# Altium schematic sheet Smart 4S and 5S switchable BMS [BQ769200].SchDoc (part 1 of 2)
size A3; SheetNumber: 1; SheetTotal: 1
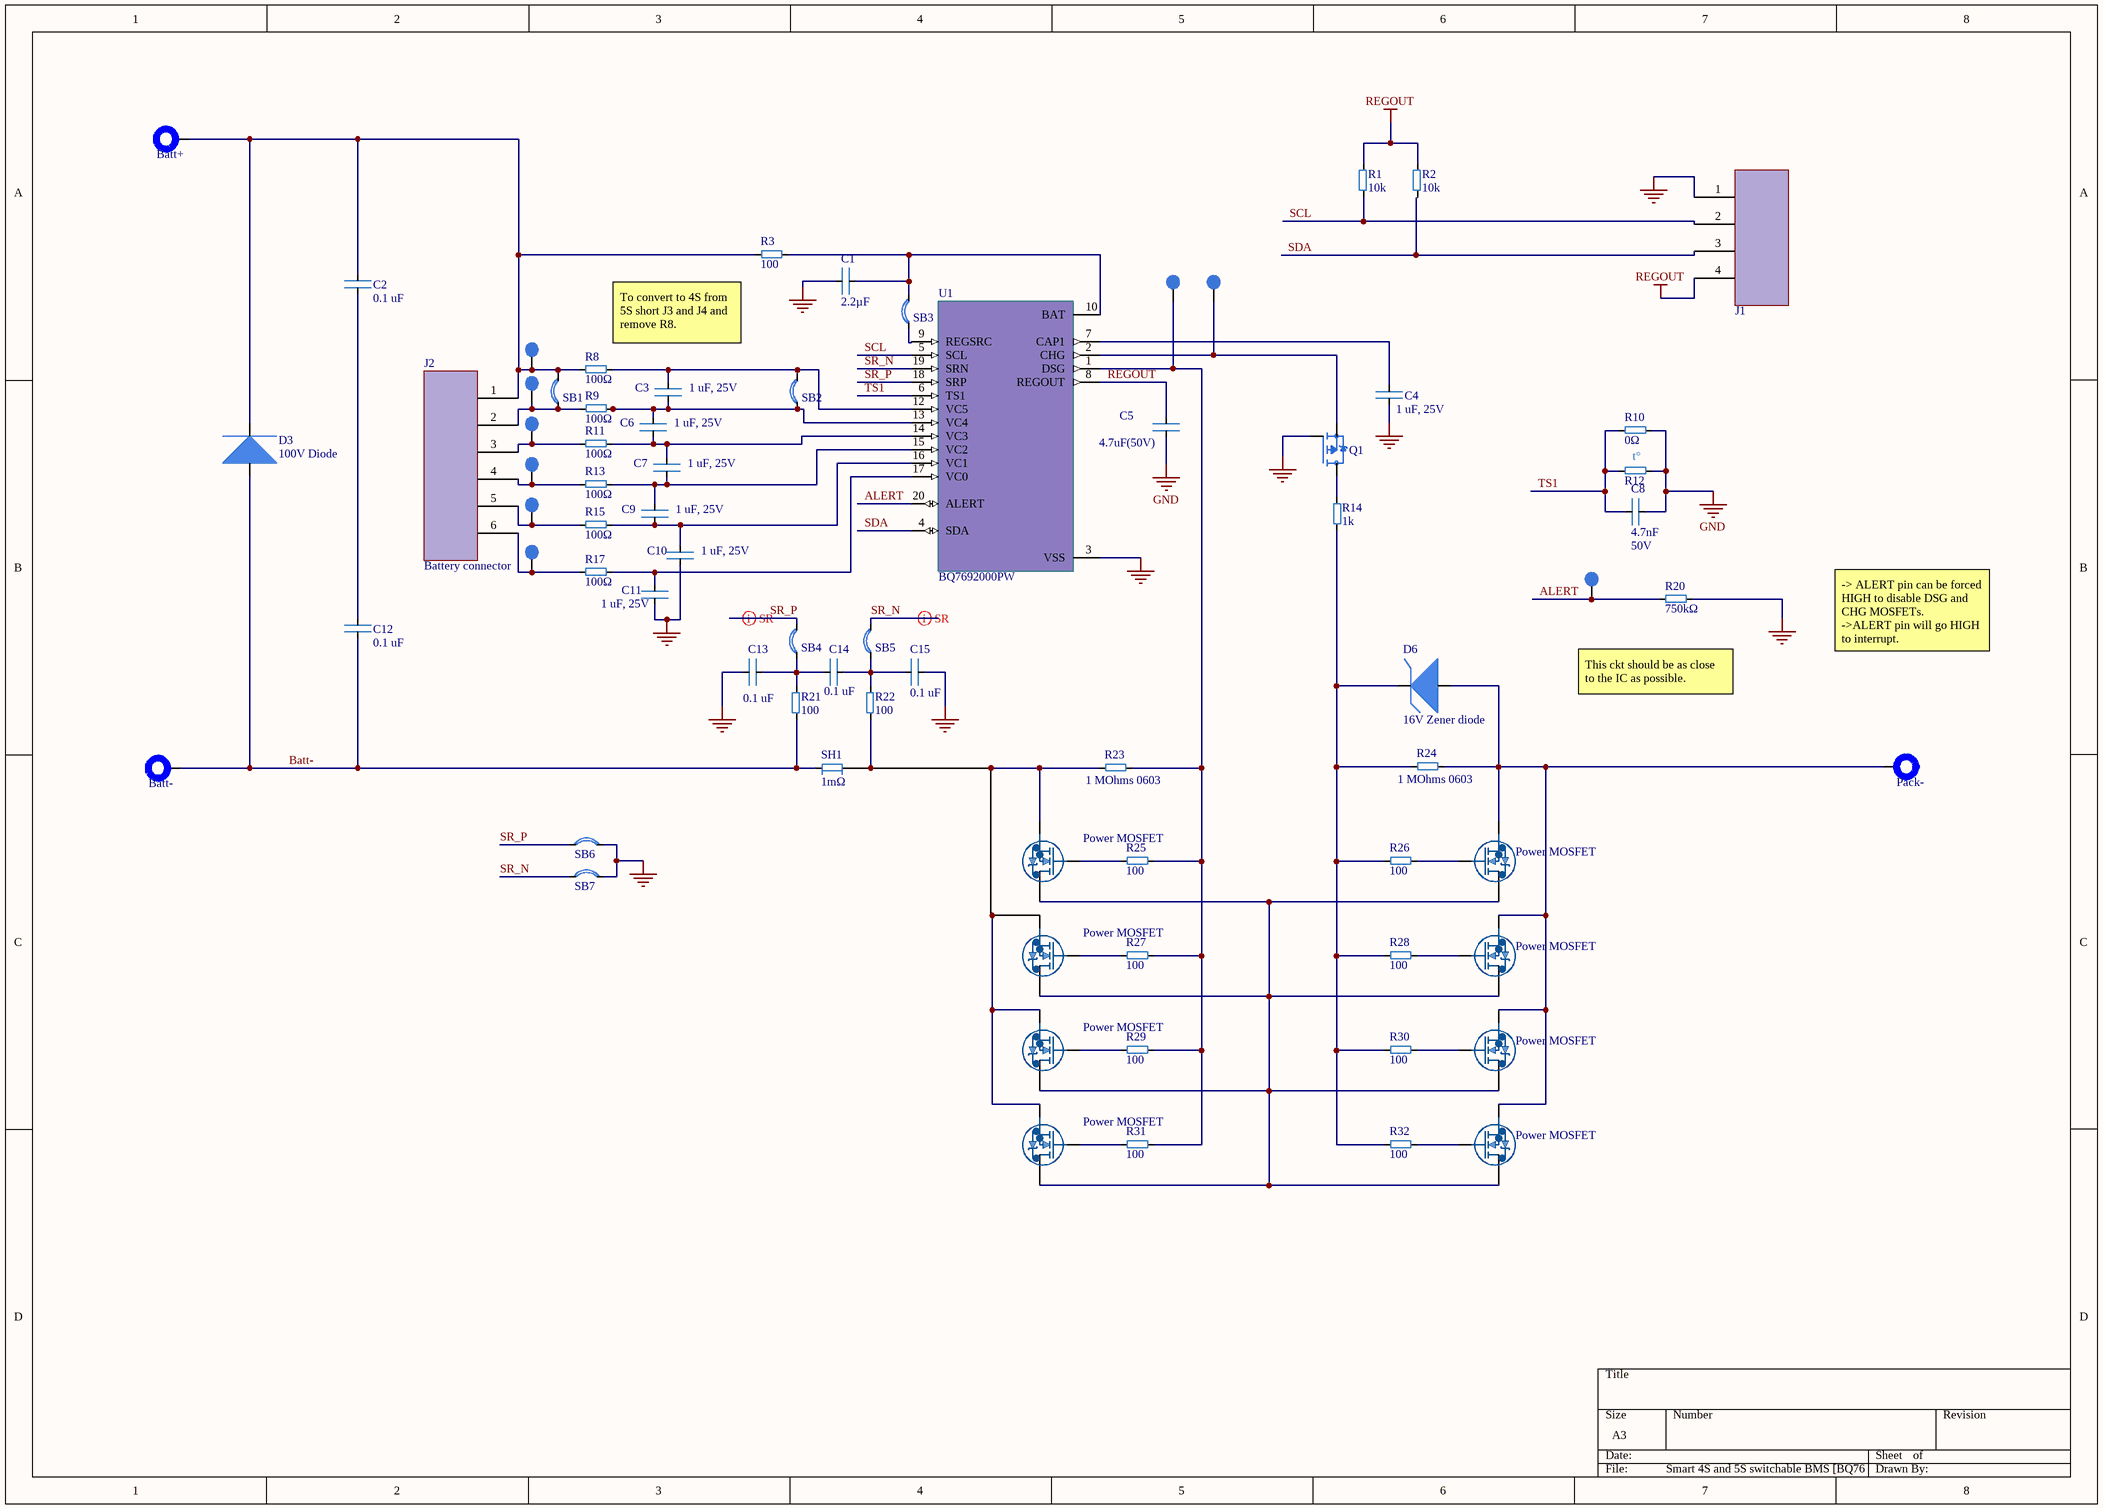
[diagram p0: Smart 4S and 5S switchable BMS [BQ769200].SchDoc]

## Parts
Batt+  Power pad  [Power through hole pads]  (value not drawn)
Batt-  Power pad  [Power through hole pads]  (value not drawn)
C1  value 2.2µF  [C0805]  (hidden comment: 2.2uF)
C2  0.1 uF  [C0805]
C3  1 uF, 25V  [C0805]
C4  1 uF, 25V  [C0805]
C5  4.7uF(50V)  [C0805]
C6  1 uF, 25V  [C0805]
C7  1 uF, 25V  [C0805]
C8  50V  value 4.7nF  [C0805]
C9  1 uF, 25V  [C0805]
C10  1 uF, 25V  [C0805]
C11  1 uF, 25V  [C0805]
C12  0.1 uF  [C0805]
C13  0.1 uF  [C0805]
C14  0.1 uF  [C0805]
C15  0.1 uF  [C0805]
D3  100V Diode  [Diode 100V]
D6  16V Zener diode  [Zener diode 16V]
J1  Headers  [4 pin 2.54mm male header]  (value not drawn)
J2  Battery connector  [6 pin 2.54mm male header]
Pack-  Power pad  [Power through hole pads]  (value not drawn)
Q1  200mW  [P-CH 50V 130MA]  (value not drawn)
Q2  Power MOSFET  [GSFP06120]
Q3  Power MOSFET  [GSFP06120]
Q4  Power MOSFET  [GSFP06120]
Q5  Power MOSFET  [GSFP06120]
Q6  Power MOSFET  [GSFP06120]
Q7  Power MOSFET  [GSFP06120]
Q8  Power MOSFET  [GSFP06120]
Q9  Power MOSFET  [GSFP06120]
R1  10k  [BO_CR0603]
R2  10k  [BO_CR0603]
R3  100  [BO_CR0603]
R8  value 100Ω  [R1206]  (hidden comment: 100)
R9  value 100Ω  [R1206]  (hidden comment: 100)
R10  value 0Ω  [BO_CR0603]  (hidden comment: 0.25W)
R11  value 100Ω  [R1206]  (hidden comment: 100)
R12  Thermistor  [AT-2_SMI]  (value not drawn)
R13  value 100Ω  [R1206]  (hidden comment: 100)
R14  1k  [BO_CR0603]
R15  value 100Ω  [R1206]  (hidden comment: 100)
R17  value 100Ω  [R1206]  (hidden comment: 100)
R20  value 750kΩ  [BO_CR0603]  (hidden comment: 750)
R21  100  [BO_CR0603]
R22  100  [BO_CR0603]
R23  1 MOhms 0603  [BO_CR0603]
R24  1 MOhms 0603  [BO_CR0603]
R25  100  [BO_CR0603]
R26  100  [BO_CR0603]
R27  100  [BO_CR0603]
R28  100  [BO_CR0603]
R29  100  [BO_CR0603]
R30  100  [BO_CR0603]
R31  100  [BO_CR0603]
R32  100  [BO_CR0603]
SB1  Solder bridge  [Solder Bridge]  (value not drawn)
SB2  Solder bridge  [Solder Bridge]  (value not drawn)
SB3  Solder bridge  [Solder Bridge]  (value not drawn)
SB4  Solder bridge  [Solder Bridge]  (value not drawn)
SB5  Solder bridge  [Solder Bridge]  (value not drawn)
SB6  Solder bridge  [Solder Bridge]  (value not drawn)
SB7  Solder bridge  [Solder Bridge]  (value not drawn)
SH1  value 1mΩ  [1mOhms CSR]  (hidden comment: 10W)
TP5  Pad  [Test Point]  (value not drawn)
TP6  Pad  [Test Point]  (value not drawn)
TP7  Test Point  [Test Point]  (value not drawn)
TP9  Test Point  [Test Point]  (value not drawn)
TP11  Test Point  [Test Point]  (value not drawn)
TP13  Test Point  [Test Point]  (value not drawn)
TP15  Test Point  [Test Point]  (value not drawn)
TP17  Pad  [Test Point]  (value not drawn)
TP18  Test Point  [Test Point]  (value not drawn)
U1  BQ7692000PW  [BQ7692]

## Nets
GND: C1.1 C4.1 C5.1 C8.2 C10.1 C11.1 C13.1 C15.2 J1.1 Q1.1(G) R10.2 R12.2 R20.2 SB6.2 SB7.2 U1.3(VSS)
REGOUT: C5.2 J1.4 R1.2 R2.2 U1.8(REGOUT)
ALERT: R20.1 TP17.1 U1.20(ALERT)
Batt-: Batt-.1 C12.1 D3.2 R21.1 SH1.1
SCL: J1.2 R1.1 U1.5(SCL)
SDA: J1.3 R2.1 U1.4(SDA)
SR_N: SB5.2 SB7.1 U1.19(SRN)
SR_P: SB4.2 SB6.1 U1.18(SRP)
TS1: C8.1 R10.1 R12.1 U1.6(TS1)
NetBatt+_1: Batt+.1 C2.2 D3.1 J2.1 R3.1 R8.1 SB1.2 TP7.1
NetC1_2: C1.2 R3.2 SB3.2 U1.10(BAT)
NetC2_1: C2.1 C12.2
NetC3_1: C3.1 C6.2 R9.2 SB2.1 U1.13(VC4)
NetC3_2: C3.2 R8.2 SB2.2 U1.12(VC5)
NetC4_2: C4.2 U1.7(CAP1)
NetC6_1: C6.1 C7.2 R11.2 U1.14(VC3)
NetC7_1: C7.1 C9.2 R13.2 U1.15(VC2)
NetC9_1: C9.1 C10.2 R15.2 U1.16(VC1)
NetC11_2: C11.2 R17.2 U1.17(VC0)
NetC13_2: C13.2 C14.1 R21.2 SB4.1
NetC14_2: C14.2 C15.1 R22.2 SB5.1
NetD6_1: D6.1 R14.2 R24.1 R26.1 R28.1 R30.1 R32.1
NetD6_2: D6.2 Pack-.1 Q3.3 Q5.3 Q7.3 Q9.3 R24.2
NetJ2_2: J2.2 R9.1 SB1.1 TP9.1
NetJ2_3: J2.3 R11.1 TP11.1
NetJ2_4: J2.4 R13.1 TP13.1
NetJ2_5: J2.5 R15.1 TP15.1
NetJ2_6: J2.6 R17.1 TP18.1
NetQ1_2: Q1.2(S) TP6.1 U1.2(CHG)
NetQ1_3: Q1.3(D) R14.1
NetQ2_1: Q2.1 R25.1
NetQ2_2: Q2.2 Q3.2 Q4.2 Q5.2 Q6.2 Q7.2 Q8.2 Q9.2
NetQ2_3: Q2.3 Q4.3 Q6.3 Q8.3 R22.1 R23.1 SH1.2
NetQ3_1: Q3.1 R26.2
NetQ4_1: Q4.1 R27.1
NetQ5_1: Q5.1 R28.2
NetQ6_1: Q6.1 R29.1
NetQ7_1: Q7.1 R30.2
NetQ8_1: Q8.1 R31.1
NetQ9_1: Q9.1 R32.2
NetR23_2: R23.2 R25.2 R27.2 R29.2 R31.2 TP5.1 U1.1(DSG)
NetSB3_1: SB3.1 U1.9(REGSRC)

## Layout directives
differential pair: SR_N, SR_P

## Notes on the sheet
- To convert to 4S from 5S short J3 and J4 and remove R8.
- -> ALERT pin can be forced HIGH to disable DSG and CHG MOSFETs.
  ->ALERT pin will go HIGH to interrupt.
- This ckt should be as close to the IC as possible.
- (in symbol 10kOhms 103AT-2 NTC Thermistor) t°